# EasyEDA schematic BIT 3.json
TITLE: TRICORE | ALU | LOGIC; REV: 1.0; Date: 2022-01-03; Sheet: 5/9; Drawn By: Koehler, Paul; Company: komed3
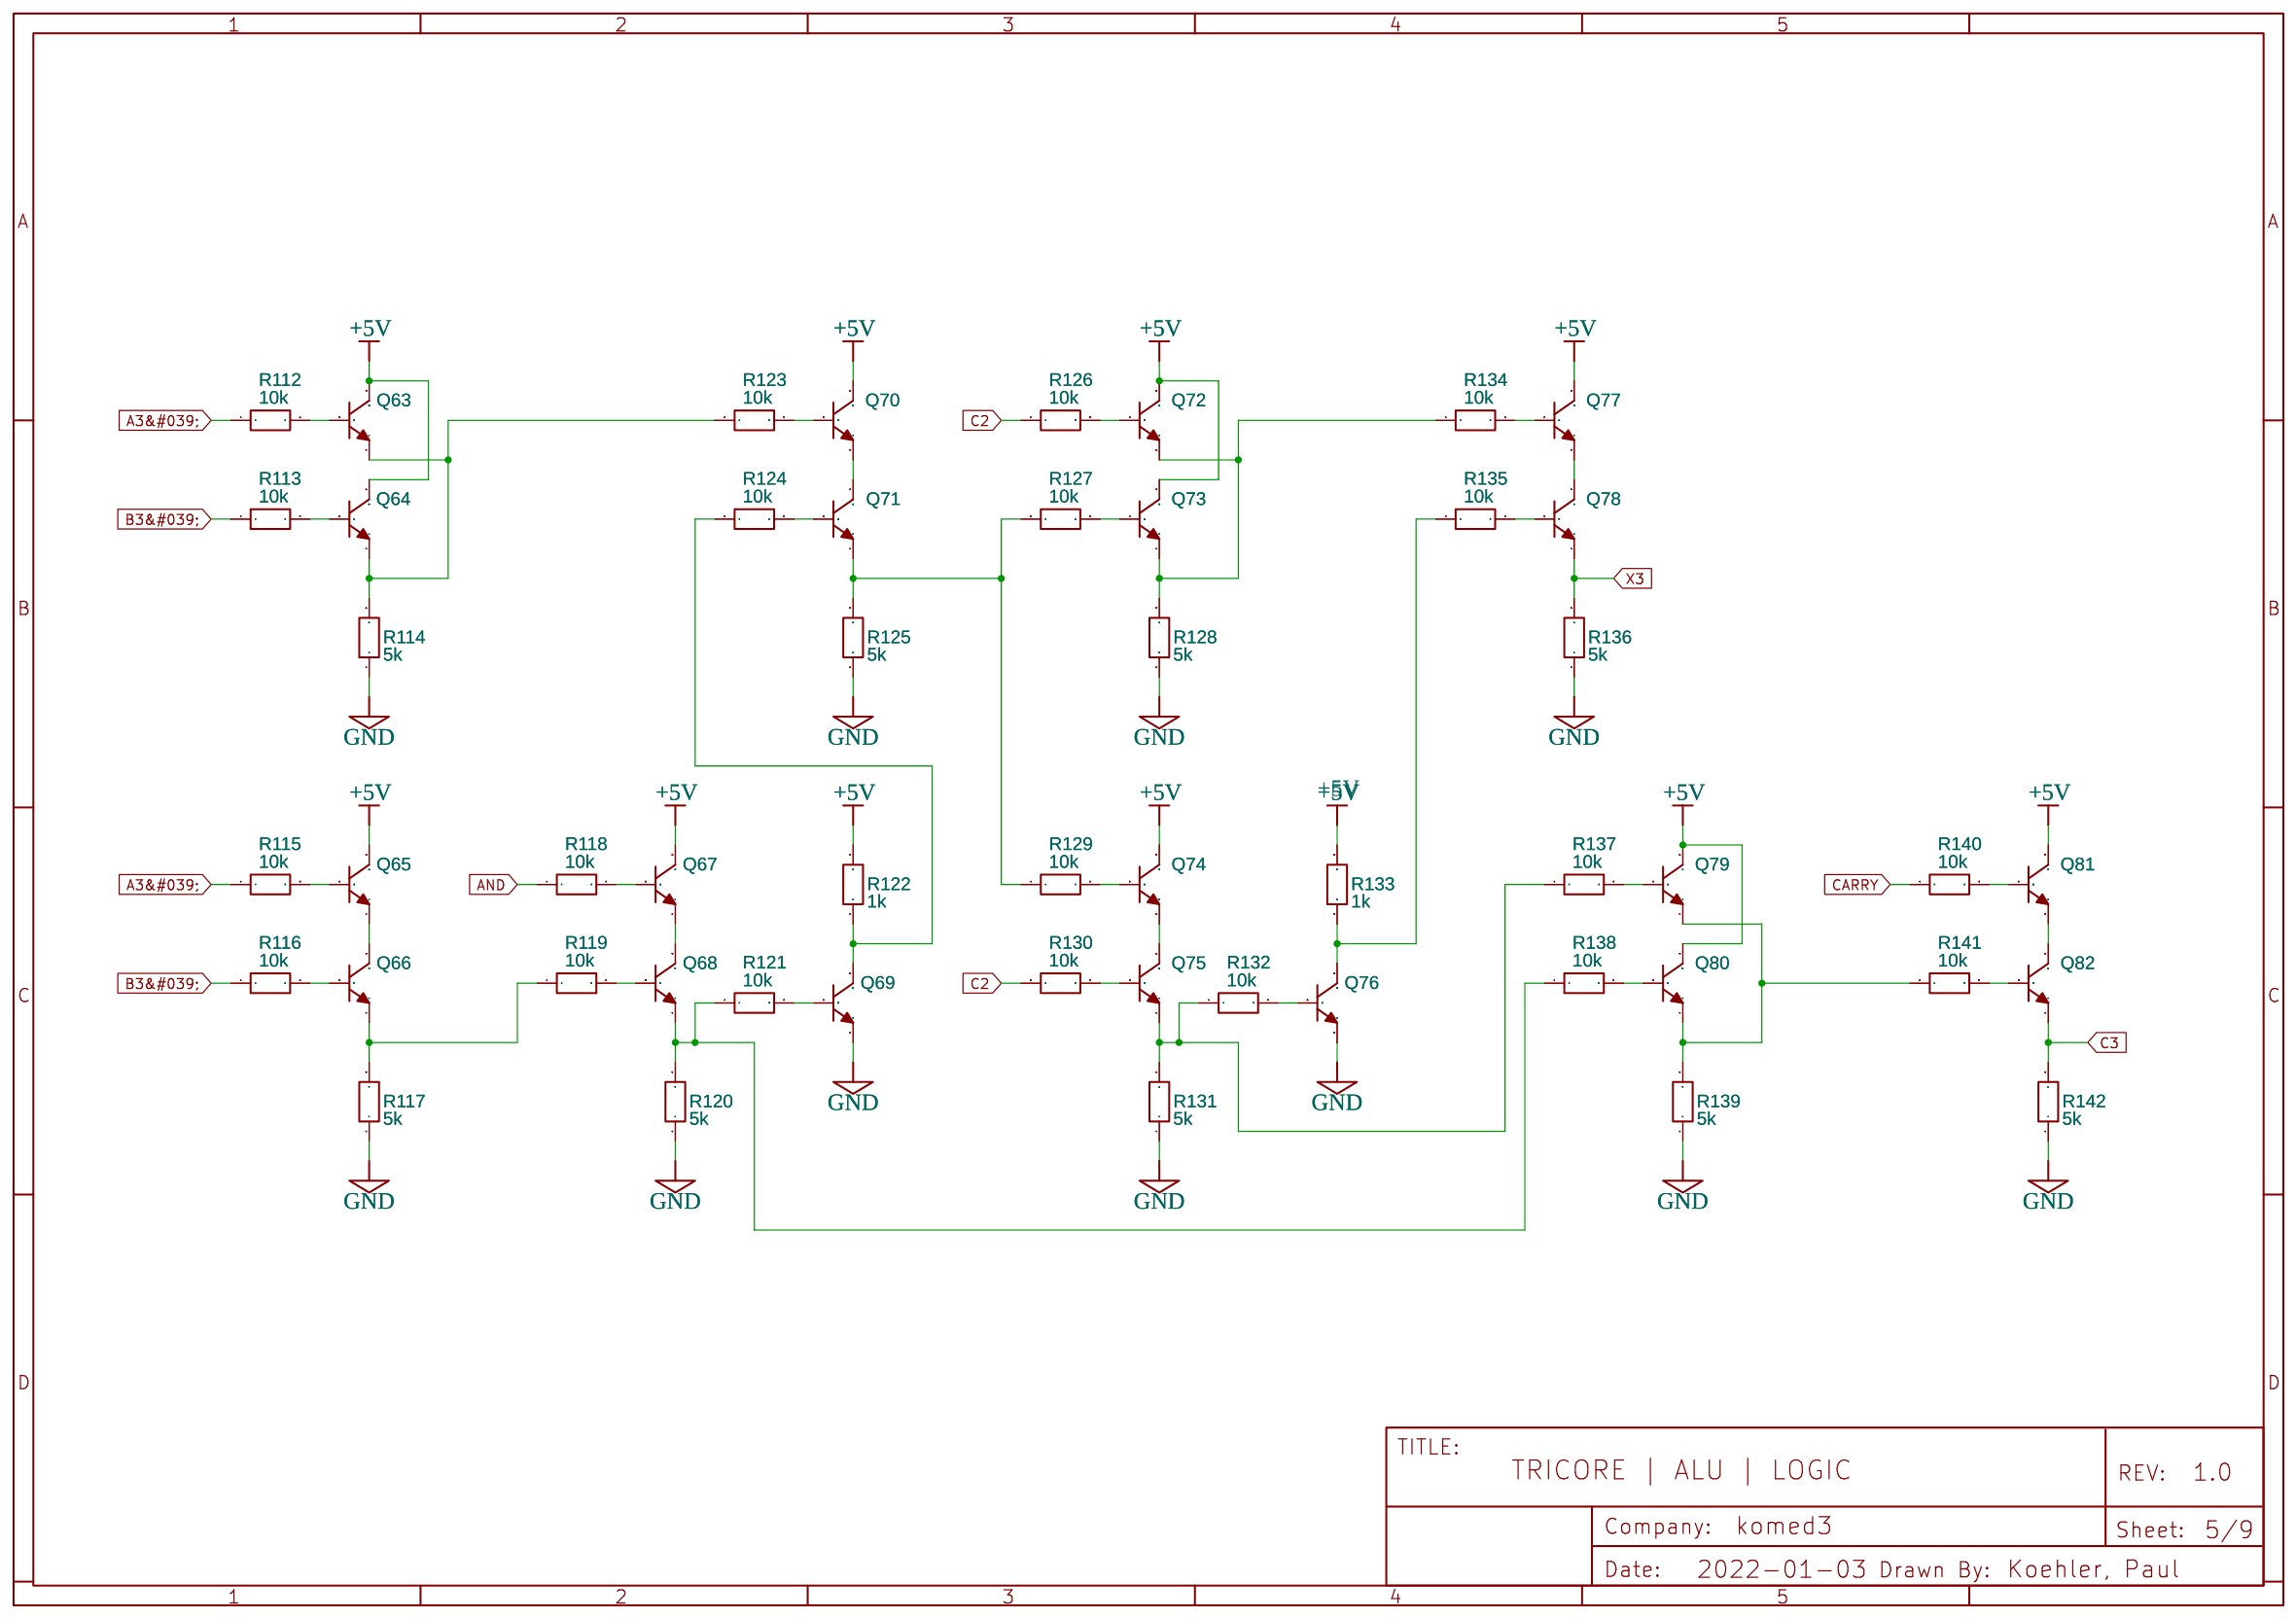
[diagram p0: schematic sheet]

## Parts
Q63  2N3904(TO-92)  [TO-92-3_L5.1-W4.1-P1.27-L]
Q64  2N3904(TO-92)  [TO-92-3_L5.1-W4.1-P1.27-L]
Q65  2N3904(TO-92)  [TO-92-3_L5.1-W4.1-P1.27-L]
Q66  2N3904(TO-92)  [TO-92-3_L5.1-W4.1-P1.27-L]
Q67  2N3904(TO-92)  [TO-92-3_L5.1-W4.1-P1.27-L]
Q68  2N3904(TO-92)  [TO-92-3_L5.1-W4.1-P1.27-L]
Q69  2N3904(TO-92)  [TO-92-3_L5.1-W4.1-P1.27-L]
Q70  2N3904(TO-92)  [TO-92-3_L5.1-W4.1-P1.27-L]
Q71  2N3904(TO-92)  [TO-92-3_L5.1-W4.1-P1.27-L]
Q72  2N3904(TO-92)  [TO-92-3_L5.1-W4.1-P1.27-L]
Q73  2N3904(TO-92)  [TO-92-3_L5.1-W4.1-P1.27-L]
Q74  2N3904(TO-92)  [TO-92-3_L5.1-W4.1-P1.27-L]
Q75  2N3904(TO-92)  [TO-92-3_L5.1-W4.1-P1.27-L]
Q76  2N3904(TO-92)  [TO-92-3_L5.1-W4.1-P1.27-L]
Q77  2N3904(TO-92)  [TO-92-3_L5.1-W4.1-P1.27-L]
Q78  2N3904(TO-92)  [TO-92-3_L5.1-W4.1-P1.27-L]
Q79  2N3904(TO-92)  [TO-92-3_L5.1-W4.1-P1.27-L]
Q80  2N3904(TO-92)  [TO-92-3_L5.1-W4.1-P1.27-L]
Q81  2N3904(TO-92)  [TO-92-3_L5.1-W4.1-P1.27-L]
Q82  2N3904(TO-92)  [TO-92-3_L5.1-W4.1-P1.27-L]
R112  10k  [0.25W-RESISTOR-VERTICAL]
R113  10k  [0.25W-RESISTOR-VERTICAL]
R114  5k  [0.25W-RESISTOR-VERTICAL]
R115  10k  [0.25W-RESISTOR-VERTICAL]
R116  10k  [0.25W-RESISTOR-VERTICAL]
R117  5k  [0.25W-RESISTOR-VERTICAL]
R118  10k  [0.25W-RESISTOR-VERTICAL]
R119  10k  [0.25W-RESISTOR-VERTICAL]
R120  5k  [0.25W-RESISTOR-VERTICAL]
R121  10k  [0.25W-RESISTOR-VERTICAL]
R122  1k  [0.25W-RESISTOR-VERTICAL]
R123  10k  [0.25W-RESISTOR-VERTICAL]
R124  10k  [0.25W-RESISTOR-VERTICAL]
R125  5k  [0.25W-RESISTOR-VERTICAL]
R126  10k  [0.25W-RESISTOR-VERTICAL]
R127  10k  [0.25W-RESISTOR-VERTICAL]
R128  5k  [0.25W-RESISTOR-VERTICAL]
R129  10k  [0.25W-RESISTOR-VERTICAL]
R130  10k  [0.25W-RESISTOR-VERTICAL]
R131  5k  [0.25W-RESISTOR-VERTICAL]
R132  10k  [0.25W-RESISTOR-VERTICAL]
R133  1k  [0.25W-RESISTOR-VERTICAL]
R134  10k  [0.25W-RESISTOR-VERTICAL]
R135  10k  [0.25W-RESISTOR-VERTICAL]
R136  5k  [0.25W-RESISTOR-VERTICAL]
R137  10k  [0.25W-RESISTOR-VERTICAL]
R138  10k  [0.25W-RESISTOR-VERTICAL]
R139  5k  [0.25W-RESISTOR-VERTICAL]
R140  10k  [0.25W-RESISTOR-VERTICAL]
R141  10k  [0.25W-RESISTOR-VERTICAL]
R142  5k  [0.25W-RESISTOR-VERTICAL]

## Library data of the parts
Q63-Q82 = 2N3904(TO-92): Supplier: LCSC; Manufacturer: SEMTECH; Manufacturer Part: 2N3904; Supplier Part: C118538; Contributor: LCEDA_Lib
R112-R142 = R_AXIAL-0.3_EU: Contributor: LCEDA_Lib

## Nets
+5V: Q63.3(C) Q64.3(C) Q65.3(C) Q67.3(C) Q70.3(C) Q72.3(C) Q73.3(C) Q74.3(C) Q77.3(C) Q79.3(C) Q80.3(C) Q81.3(C) R122.2 R133.2
GND: Q69.1(E) Q76.1(E) R114.1 R117.1 R120.1 R125.1 R128.1 R131.1 R136.1 R139.1 R142.1
A3&#039;: R112.1 R115.1
AND: R118.1
B3&#039;: R113.1 R116.1
C2: R126.1 R130.1
C3: Q82.1(E) R142.2
CARRY: R140.1
X3: Q78.1(E) R136.2
Net-(Q63-1): Q63.1(E) Q64.1(E) R114.2 R123.1
Net-(Q63-2): Q63.2(B) R112.2
Net-(Q64-2): Q64.2(B) R113.2
Net-(Q65-1): Q65.1(E) Q66.3(C)
Net-(Q65-2): Q65.2(B) R115.2
Net-(Q66-1): Q66.1(E) R117.2 R119.1
Net-(Q66-2): Q66.2(B) R116.2
Net-(Q67-1): Q67.1(E) Q68.3(C)
Net-(Q67-2): Q67.2(B) R118.2
Net-(Q68-1): Q68.1(E) R120.2 R121.1 R138.1
Net-(Q68-2): Q68.2(B) R119.2
Net-(Q69-2): Q69.2(B) R121.2
Net-(Q69-3): Q69.3(C) R122.1 R124.1
Net-(Q70-1): Q70.1(E) Q71.3(C)
Net-(Q70-2): Q70.2(B) R123.2
Net-(Q71-1): Q71.1(E) R125.2 R127.1 R129.1
Net-(Q71-2): Q71.2(B) R124.2
Net-(Q72-1): Q72.1(E) Q73.1(E) R128.2 R134.1
Net-(Q72-2): Q72.2(B) R126.2
Net-(Q73-2): Q73.2(B) R127.2
Net-(Q74-1): Q74.1(E) Q75.3(C)
Net-(Q74-2): Q74.2(B) R129.2
Net-(Q75-1): Q75.1(E) R131.2 R132.1 R137.1
Net-(Q75-2): Q75.2(B) R130.2
Net-(Q76-2): Q76.2(B) R132.2
Net-(Q76-3): Q76.3(C) R133.1 R135.1
Net-(Q77-1): Q77.1(E) Q78.3(C)
Net-(Q77-2): Q77.2(B) R134.2
Net-(Q78-2): Q78.2(B) R135.2
Net-(Q79-1): Q79.1(E) Q80.1(E) R139.2 R141.1
Net-(Q79-2): Q79.2(B) R137.2
Net-(Q80-2): Q80.2(B) R138.2
Net-(Q81-1): Q81.1(E) Q82.3(C)
Net-(Q81-2): Q81.2(B) R140.2
Net-(Q82-2): Q82.2(B) R141.2

## Notes on the sheet
- +5V
